# EAGLE design nametag (EAGLE 7.1.0)
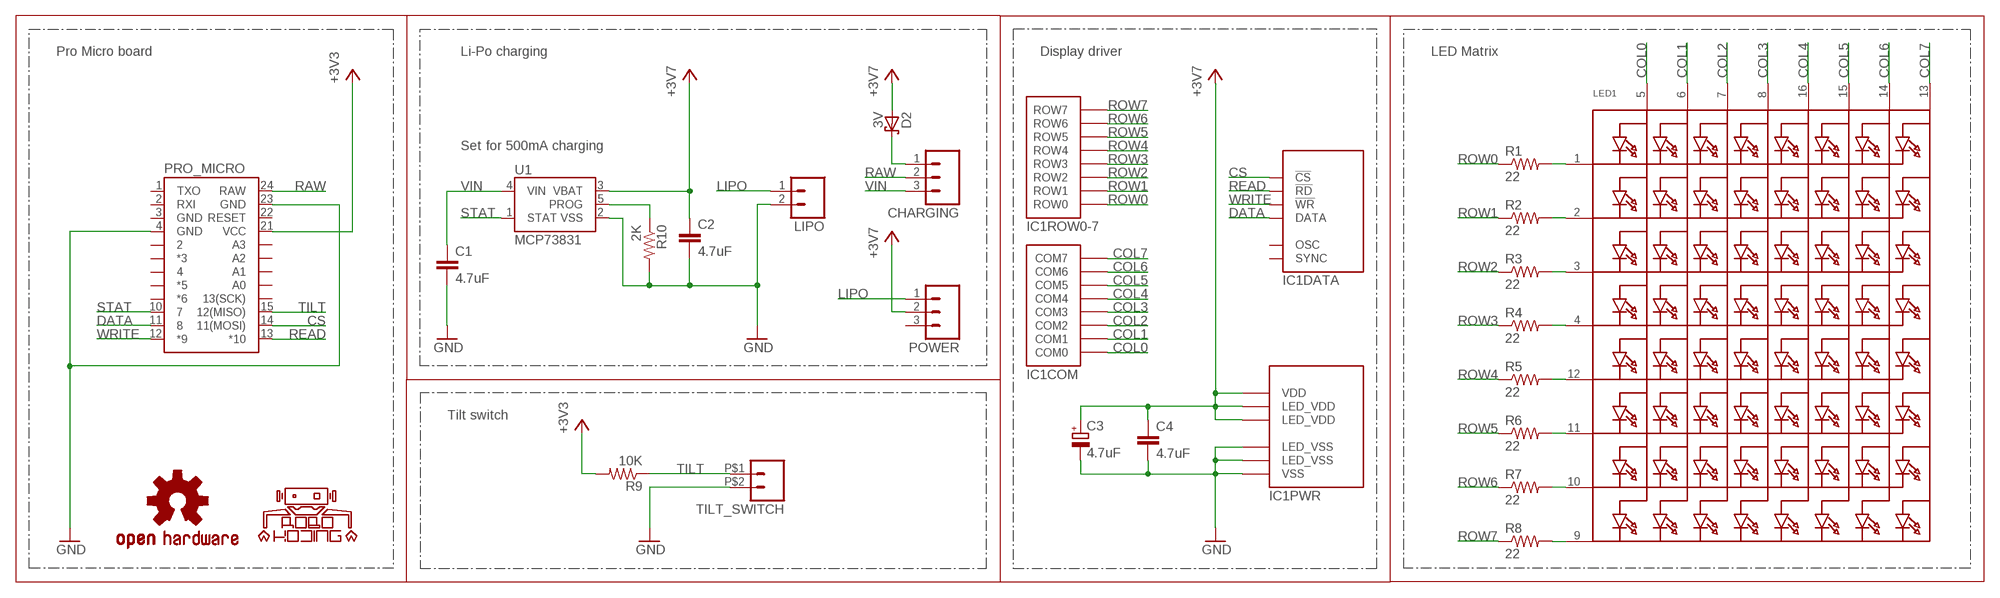
[diagram p0: schematic, sheet 1]

## Parts
C1  4.7uF  CAP0402-CAP  [0402-CAP]
C2  4.7uF  CAP0402-CAP  [0402-CAP]
C3  4.7uF  CPOL-EUB  [PANASONIC_B]
C4  4.7uF  CAP0402-CAP  [0402-CAP]
CHARGING  M03PTH  [1X03]
D2  3V  BAT60J  [SOD323_ST]
IC1  HT1632  [QFP52]
LED1  SEGMENT_8X8_ROWCATHODE  [SEGMENT_BL-M07C881UR]
LIPO  M02JST-PTH-VERT  [JST-2-PTH-VERT]
LOGO1  OSHW-LOGOS  [OSHW-LOGO-S]
LOGO2  ROBOKODING-LOGOS  [ROBOKODING-LOGO-S]
POWER  M03PTH  [1X03]
PRO_MICRO  ARDUINO_PRO_MICRO  [ARDUINO_PRO_MICRO]
R1  22  RESISTOR0402-RES  [0402-RES]
R2  22  RESISTOR0402-RES  [0402-RES]
R3  22  RESISTOR0402-RES  [0402-RES]
R4  22  RESISTOR0402-RES  [0402-RES]
R5  22  RESISTOR0402-RES  [0402-RES]
R6  22  RESISTOR0402-RES  [0402-RES]
R7  22  RESISTOR0402-RES  [0402-RES]
R8  22  RESISTOR0402-RES  [0402-RES]
R9  10K  RESISTOR0402-RES  [0402-RES]
R10  2K  RESISTOR0402-RES  [0402-RES]
TILT_SWITCH  M02PTH2  [1X02_BIG]
U1  MCP73831  [SOT23-5]

## Nets
+3V3: C2.1 C3.+ C4.1 D2.A IC1.P$7(PWR:LED_VDD) IC1.P$21(PWR:VDD) IC1.P$38(PWR:LED_VDD) POWER.2 U1.3(VBAT) ; supply symbol labelled +3V7
COL0: IC1.P$22(COM:COM0) LED1.5(A1)
COL1: IC1.P$23(COM:COM1) LED1.6(A2)
COL2: IC1.P$24(COM:COM2) LED1.7(A3)
COL3: IC1.P$26(COM:COM3) LED1.8(A4)
COL4: IC1.P$27(COM:COM4) LED1.16(A5)
COL5: IC1.P$28(COM:COM5) LED1.15(A6)
COL6: IC1.P$29(COM:COM6) LED1.14(A7)
COL7: IC1.P$30(COM:COM7) LED1.13(A8)
CS: IC1.P$19(DATA:!CS) PRO_MICRO.14(11(MOSI))
DATA: IC1.P$16(DATA:DATA) PRO_MICRO.11
GND: C1.2 C2.2 C3.- C4.2 IC1.P$14(PWR:VSS) IC1.P$25(PWR:LED_VSS) IC1.P$36(PWR:LED_VSS) LIPO.2 PRO_MICRO.4(GND) PRO_MICRO.23(GND) R10.2 TILT_SWITCH.P$2 U1.2(VSS)
LIPO: LIPO.1 POWER.1
N$1: LED1.1(K1) R1.2
N$2: LED1.2(K2) R2.2
N$3: CHARGING.1 D2.C
N$4: LED1.3(K3) R3.2
N$5: LED1.4(K4) R4.2
N$6: LED1.12(K5) R5.2
N$7: LED1.11(K6) R6.2
N$8: LED1.10(K7) R7.2
N$9: LED1.9(K8) R8.2
PROG: R10.1 U1.5(PROG)
RAW: CHARGING.2 PRO_MICRO.24(RAW)
READ: IC1.P$18(DATA:!RD) PRO_MICRO.13(*10)
ROW0: IC1.P$13(ROW0-7:ROW0) R1.1
ROW1: IC1.P$12(ROW0-7:ROW1) R2.1
ROW2: IC1.P$11(ROW0-7:ROW2) R3.1
ROW3: IC1.P$10(ROW0-7:ROW3) R4.1
ROW4: IC1.P$9(ROW0-7:ROW4) R5.1
ROW5: IC1.P$8(ROW0-7:ROW5) R6.1
ROW6: IC1.P$6(ROW0-7:ROW6) R7.1
ROW7: IC1.P$5(ROW0-7:ROW7) R8.1
STAT: PRO_MICRO.10 U1.1(STAT)
TILT: PRO_MICRO.15(12(MISO)) R9.1 TILT_SWITCH.P$1
VCC: PRO_MICRO.21(VCC) R9.2 ; supply symbol labelled +3V3
VIN: C1.1 CHARGING.3 U1.4(VIN)
WRITE: IC1.P$17(DATA:!WR) PRO_MICRO.12(*9)
Unconnected: IC1.P$1(ROW8-15:ROW11) IC1.P$2(ROW8-15:ROW10) IC1.P$3(ROW8-15:ROW9) IC1.P$4(ROW8-15:ROW8) IC1.P$15(DATA:OSC) IC1.P$20(DATA:SYNC) IC1.P$31(ROW24-31/COL8-15:ROW31) IC1.P$32(ROW24-31/COL8-15:ROW30) IC1.P$33(ROW24-31/COL8-15:ROW29) IC1.P$34(ROW24-31/COL8-15:ROW28) IC1.P$35(ROW24-31/COL8-15:ROW27) IC1.P$37(ROW24-31/COL8-15:ROW26) IC1.P$39(ROW24-31/COL8-15:ROW25) IC1.P$43(ROW16-23:ROW21) IC1.P$44(ROW16-23:ROW20) IC1.P$45(ROW16-23:ROW19) IC1.P$46(ROW16-23:ROW18) IC1.P$47(ROW16-23:ROW17) IC1.P$48(ROW16-23:ROW16) IC1.P$49(ROW8-15:ROW15) POWER.3 PRO_MICRO.1(TXO) PRO_MICRO.2(RXI) PRO_MICRO.3(GND) PRO_MICRO.22(RESET)

## Notes on the sheet
- Pro Micro board | Li-Po charging | Display driver | LED Matrix
- Set for 500mA charging
- Tilt switch

## Library data of the parts
C1 C2 C4 = SparkFun:CAP: Capacitor Standard 0603 ceramic capacitor, and 0.1" leaded capacitor.
C3 = rcl:CPOL-EU: POLARIZED CAPACITOR, European symbol
CHARGING POWER = SparkFun-Connectors:M03: Header 3 Standard 3-pin 0.1" header. Use with straight break away headers (SKU : PRT-00116), right angle break away headers (PRT-00553), swiss pins (PRT-00743), machine pins (PRT-00117), and female headers (PRT-00115). Molex polarized connector foot print use with SKU : PRT-08232 with associated crimp pins and housings.
D2 = diode:BAT60J: Schottky barrier diode Source: www.st.com, BAT60J.pdf
IC1 = ht1632:HT1632
LED1 = adafruit:SEGMENT_8X8_ROWCATHODE: 8x8 LED Segment Displays: Row = Cathode 0.7" Red 8X8 Matrix, 1.9mm Round LEDs - BL-M07C881UR 1.2" Red 8x8 Matrix, 3.0mm Round LEDs - BL-M12A881UR 1.2" Red 8x8 Matrix, 3.0mm Square LEDs - BL-M12A883
LIPO TILT_SWITCH = SparkFun-Connectors:M02: Standard 2-pin 0.1" header. Use with - straight break away headers ( PRT-00116) - right angle break away headers (PRT-00553) - swiss pins (PRT-00743) - machine pins (PRT-00117) - female headers (PRT-00115) Molex polarized connector foot print use with: PRT-08233 with associated crimp pins and housings. 2.54_SCREWTERM for use with PRT-10571. 3.5mm Screw Terminal footprints for PRT-08084 5mm Screw Terminal footprints for use with PRT-08432
LOGO1 = SparkFun-Aesthetics:OSHW-LOGO: Open Source Hardware Logo This logo indicates the piece of hardware it is found on incorporates a OSHW license and/or adheres to the definition of open source hardware found here: http://freedomdefined.org/OSHW
LOGO2 = Sumorobot:ROBOKODING-LOGO: Robokoding logo This logo indicates that the piece of hardware was developed by the RoboKoding community. RoboKoding is a organisation that focuses on teaching everyone building and programming robots: http://www.robokoding.com
PRO_MICRO = SparkFun-Boards:ARDUINO_PRO_MICRO
R1-R10 = SparkFun:RESISTOR: Resistor Basic schematic elements and footprints for 0603, 1206, and PTH resistors.
U1 = SparkFun:MCP73831: Microchip's MCP73831 Miniature single cell, fully integrated Li-Ion, Li-polymer charge management controller http://ww1.microchip.com/downloads/en/DeviceDoc/21984a.pdf

## Board
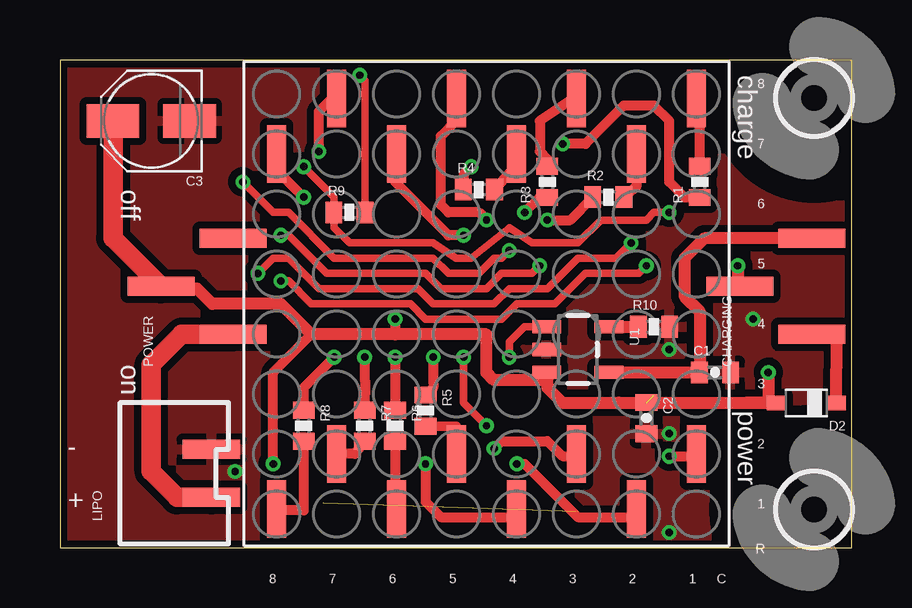
[diagram p1: board, top side]
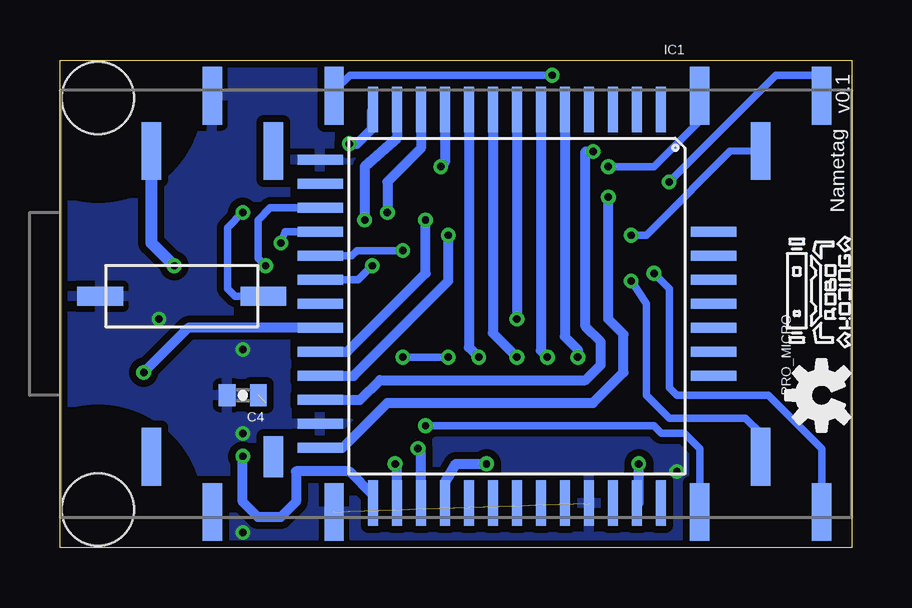
[diagram p2: board, bottom side, seen from below]

Size 33.02 x 20.32 mm. Coordinates in mm from the lower left corner, seen from the top.
Outline: 0,20.32 0,0 33.02,0 33.02,20.32 0,20.32
Copper layers (1*16): Top 0.035mm / dielectric 1.5mm / Bottom 0.035mm
Design rules "dirt_cheap_dirty_boards.v1": minimum track width 5mil, minimum drill 12mil, track to track 5mil, track to pad 5mil, pad to pad 5mil, via to via 5mil, smd to smd 0mil, copper to edge 10mil, drill to drill 10mil, minimum pad ring 10mil, minimum via ring 6mil, stop-mask expansion 2mil, vias tented up to drill 25mil, thermal gap 10mil

### Footprints (pad centres in the part's own frame; a part is rotated, then mirrored left to right if it is on the bottom)
0402-CAP = smd 0.7 x 0.9: 1 -0.65,0; 2 0.65,0
PANASONIC_B = smd 2.2 x 1.4: + 1.6,0; - -1.6,0
1X03 = smd 0.806 x 2.8: 1 0,-1.5; 2 2,1.5; 3 4,-1.5
SOD323_ST = smd 0.8 x 0.6: A 1.25,0; C -1.25,0
QFP52 = smd 0.406 x 1.9: P$1 -6,-8.1; P$2 -5,-8.1; P$3 -4,-8.1; P$4 -3,-8.1; P$5 -2,-8.1; P$6 -1,-8.1; P$7 0,-8.1; P$8 1,-8.1; P$9 2,-8.1; P$10 3,-8.1; P$11 4,-8.1; P$12 5,-8.1; P$13 6,-8.1; P$27 6,8.3; P$28 5,8.3; P$29 4,8.3; P$30 3,8.3; P$31 2,8.3; P$32 1,8.3; P$33 0,8.3; P$34 -1,8.3; P$35 -2,8.3; P$36 -3,8.3; P$37 -4,8.3; P$38 -5,8.3; P$39 -6,8.3 | smd 1.9 x 0.406: P$14 8.2,-6; P$15 8.2,-5; P$16 8.2,-4; P$17 8.2,-3; P$18 8.2,-2; P$19 8.2,-1; P$20 8.2,0; P$21 8.2,1; P$22 8.2,2; P$23 8.2,3; P$24 8.2,4; P$25 8.2,5; P$26 8.2,6; P$43 -8.2,3; P$44 -8.2,2; P$45 -8.2,1; P$46 -8.2,0; P$47 -8.2,-1; P$48 -8.2,-2; P$49 -8.2,-3
SEGMENT_BL-M07C881UR = smd 0.806 x 2.4: 1 -8.75,-8.55; 2 -6.25,-6.25; 3 -3.75,-8.55; 4 -1.25,-6.25; 5 1.25,-8.55; 6 3.75,-6.25; 7 6.25,-8.55; 8 8.75,-6.25; 9 8.75,8.55; 10 6.25,6.25; 11 3.75,8.55; 12 1.25,6.25; 13 -1.25,8.55; 14 -3.75,6.25; 15 -6.25,8.55; 16 -8.75,6.25
JST-2-PTH-VERT = smd 0.806 x 2.4: 1 -1,-1.55; 2 1,-1.55
ARDUINO_PRO_MICRO = smd 2.4 x 0.806: 1 -6.37,12.7; 2 -8.67,10.16; 4 -8.67,5.08; 10 -8.67,-10.16; 11 -6.37,-12.7; 12 -8.67,-15.24; 13 8.67,-15.24; 14 6.37,-12.7; 15 8.67,-10.16; 21 8.67,5.08; 22 6.37,7.62; 23 8.67,10.16; 24 6.37,12.7 | smd 1.7 x 0.806: 3 -6.37,7.62
0402-RES = smd 0.7 x 0.9: 1 -0.65,0; 2 0.65,0
1X02_BIG = smd 1.9 x 0.806: P$1 -1.5,0; P$2 5.31,0
SOT23-5 = smd 0.55 x 1.2: 1 -0.95,-1.3; 2 0,-1.3; 3 0.95,-1.3; 4 0.95,1.3; 5 -0.95,1.3
3,0 = hole 3: 0,0

### Placement (x,y rotation side)
C1  27.3,7.3 0 top
C2  24.45,5.4 270 top
C3  3.81,17.78 180 top
C4  25.4,6.35 180 bottom
CHARGING  29.84,8.89 90 top
D2  31.11,6.03 180 top
IC1  13.97,10.16 180 bottom
LED1  17.78,10.16 180 top
LIPO  4.76,3.1 90 top
LOGO1  1.27,6.35 90 bottom
LOGO2  0,8.26 90 bottom
POWER  5.71,8.89 90 top
PRO_MICRO  16.51,10.16 90 bottom
R1  26.67,15.24 90 top
R2  22.86,14.61 0 top
R3  20.32,15.24 90 top
R4  17.46,14.92 0 top
R5  15.24,5.71 270 top
R6  13.97,5.08 270 top
R7  12.7,5.08 270 top
R8  10.16,5.08 270 top
R9  12.06,13.97 0 top
R10  24.77,9.21 0 top
TILT_SWITCH  26.04,10.48 180 bottom
U1  21.59,8.26 270 top
U$1  [3,0]  31.43,18.73 0 top
U$2  [3,0]  31.43,1.59 0 top

### Tracks (layer width: path | path; a pad name or v marks a point on that pad's centre or on a via)
+3V3  (via drill 0.31)  (1 unrouted)
  Top 0.406: v13.97,9.53 13.97,8.89 | v8.89,3.49 8.89,7.3 10.48,8.89
  Top 0.508: POWER.2 4.31,10.79 5.71,10.79 6.35,10.16 9.21,10.16 10.48,8.89 13.97,8.89 17.78,8.89 17.78,7.3 18.1,6.99 20.32,6.99 U1.3 20.32,6.67 20.95,6.03 arc0 C2.1 29.53,6.03 | v29.53,7.3 29.53,6.03 | 29.53,6.03 28.57,6.03 | 29.53,6.03 D2.A
  Top 0.813: C3.+ 2.21,12.89 POWER.2
  Bottom 0.406: IC1.P$7 v13.97,9.53 | IC1.P$21 27.67,9.16 v29.53,7.3 | IC1.P$38 8.89,1.86 v8.89,3.49
COL0  (via drill 0.31)
  Top 0.406: v17.78,13.65 17.46,13.97 16.19,13.97 15.88,14.29 15.88,17.14 16.51,17.78 16.51,18.71 | 16.53,18.91 16.51,18.89 16.51,18.73 16.51,18.71 | LED1.5 16.51,18.71
  Bottom 0.406: IC1.P$22 21.05,8.16 17.78,11.43 v17.78,13.65
COL1  (via drill 0.31)
  Top 0.406: v16.83,13.02 16.19,13.02 13.97,15.24 13.97,16.35 LED1.6
  Bottom 0.406: IC1.P$23 20.78,7.16 16.83,11.11 v16.83,13.02
COL2  (via drill 0.31)
  Top 0.406: v10.79,16.51 10.79,18.18 11.39,18.77 | 11.39,18.77 11.53,18.91 | LED1.7 11.39,18.71 11.39,18.77
  Bottom 0.406: IC1.P$24 20.51,6.16 19.68,6.99 11.11,6.99 10.48,7.62 10.48,8.57 11.11,9.21 11.11,16.51 v10.79,16.51
COL3  (via drill 0.31)
  Top 0.406: v10.16,14.61 9.03,15.73 LED1.8
  Bottom 0.406: IC1.P$26 21.24,4.16 19.37,6.03 10.79,6.03 9.53,7.3 9.53,8.89 10.16,9.53 v10.16,14.61
COL4  (via drill 0.31)
  Top 0.406: v25.4,3.81 26.43,3.81 LED1.16
  Bottom 0.406: IC1.P$27 19.97,2.19 20.95,3.17 23.18,3.17 23.18,1.91 23.81,1.27 24.77,1.27 25.4,1.91 v25.4,3.81
COL5  (via drill 0.31)
  Top 0.406: v19.05,3.49 19.37,3.49 21.59,1.27 23.89,1.27 24.03,1.41 LED1.15
  Bottom 0.406: IC1.P$28 18.97,3.25 v19.05,3.49
COL6  (via drill 0.31)
  Top 0.406: v18.1,4.13 18.41,4.45 20.32,4.45 20.95,3.81 21.43,3.81 LED1.14
  Bottom 0.406: IC1.P$29 17.97,3.94 v18.1,4.13
COL7  (via drill 0.31)
  Top 0.406: v15.24,3.49 15.24,1.91 15.88,1.27 18.89,1.27 19.03,1.41 LED1.13
  Bottom 0.406: IC1.P$30 16.97,2.71 16.51,3.49 v15.24,3.49
CS  (via drill 0.31)
  Top 0.305: v20,11.75 19.68,11.43 18.41,11.43 17.78,10.79 15.88,10.79 15.24,11.43 11.11,11.43 9.53,13.02 v9.21,13.02
  Bottom 0.305: IC1.P$19 20.59,11.16 v20,11.75 | v9.21,13.02 8.57,13.02 8.26,13.34 5.1,16.51 PRO_MICRO.14
DATA  (via drill 0.31)
  Top 0.305: v24.45,11.75 24.13,11.43 21.91,11.43 20.64,10.16 19.05,10.16 18.41,9.53 15.24,9.53 14.61,10.16 10.48,10.16 9.53,11.11 v9.21,11.11
  Bottom 0.305: IC1.P$16 24.26,14.16 24.77,13.65 24.77,12.06 v24.45,11.75 | v9.21,11.11 8.57,10.16 8.57,6.35 7.62,5.4 4.45,5.4 3.81,4.76 PRO_MICRO.11
GND  (via drill 0.31)  (1 unrouted)
  other vias: 25.4,0.64 25.4,8.26 7.3,3.17 25.4,4.76 28.89,9.53
  pour Bottom (isolate 0.3): -0.64,20.95 33.66,20.95 33.66,-0.64 -0.64,-0.64
  pour Top (isolate 0.3): -0.32,20.64 33.34,20.64 33.34,-0.32 -0.32,-0.32
LIPO
  Top 0.813: LIPO.1 4.88,2.1 3.81,3.17 3.81,7.62 5.08,8.89 POWER.1
N$1
  Top 0.406: R1.2 26.67,18.77 | 26.67,18.77 26.53,18.91 | 26.67,18.77 26.53,18.77 LED1.1
N$2
  Top 0.406: LED1.2 24.03,15.04 R2.2
N$3
  Top 0.508: D2.C 32.38,8.89 31.43,8.89 31.41,8.96 CHARGING.1
N$4
  Top 0.406: 21.53,18.91 21.53,18.81 | LED1.3 21.53,18.81 | 21.53,18.81 20,17.78 20,16.51 20.32,16.19 R3.2
N$5
  Top 0.406: LED1.4 19.03,15.91 R4.2
N$6
  Top 0.406: LED1.12 16.53,5.04 R5.2
N$7
  Top 0.406: R6.2 13.97,1.47 14.03,1.41 LED1.11
N$8
  Top 0.406: R7.2 12.7,4.45 12.28,3.91 LED1.10
N$9
  Top 0.406: R8.2 10.16,1.55 9.03,1.55 | 9.03,1.41 8.89,1.55 9.03,1.55 | 9.03,1.55 LED1.9
PROG
  Top 0.508: U1.5 22.86,9.21 R10.1
RAW  (via drill 0.31)
  Top 0.508: v28.26,11.75 28.26,10.98 CHARGING.2
  Bottom 0.508: PRO_MICRO.24 29.21,12.7 v28.26,11.75
READ  (via drill 0.31)
  Top 0.305: v18.73,12.38 18.41,12.06 18.1,12.06 17.46,11.43 16.19,11.43 15.56,12.06 11.43,12.06 9.53,13.97 8.89,13.97 v7.62,15.24
  Bottom 0.305: IC1.P$18 20.86,12.16 20.64,12.38 v18.73,12.38 | 1.27,19.03 1.29,19.68 3.17,19.68 v7.62,15.24
  Bottom 0.406: 1.27,19.03 PRO_MICRO.13
ROW0  (via drill 0.31)
  Top 0.406: R1.1 26.05,14.59 25.4,15.24 25.4,17.78 24.77,18.41 23.5,18.41 21.91,16.83 v20.95,16.83
  Bottom 0.406: v20.95,16.83 20.64,16.83 20,17.46 20,18.23 IC1.P$13
ROW1  (via drill 0.31)
  Top 0.406: v20.32,13.65 21.27,13.65 R2.1
  Bottom 0.406: IC1.P$12 18.97,17.07 20.32,15.88 v20.32,13.65
ROW2  (via drill 0.31)
  Top 0.406: v19.37,13.97 20,14.61 R3.1
  Bottom 0.406: IC1.P$11 17.97,16.64 19.37,15.24 v19.37,13.97
ROW3  (via drill 0.31)
  Top 0.406: v17.14,15.88 16.83,15.57 R4.1
  Bottom 0.406: IC1.P$10 16.97,16.05 v17.14,15.88
ROW4  (via drill 0.31)
  Top 0.406: v15.56,7.94 15.56,6.99 15.57,6.68 R5.1
  Bottom 0.406: IC1.P$9 15.97,8.35 v15.56,7.94
ROW5  (via drill 0.31)
  Top 0.406: v13.97,7.94 R6.1
  Bottom 0.406: IC1.P$8 14.97,8.94 v13.97,7.94
ROW6  (via drill 0.31)
  Top 0.406: v12.7,7.94 12.7,6.99 12.71,6.99 R7.1
  Bottom 0.406: IC1.P$6 12.97,8.21 v12.7,7.94
ROW7  (via drill 0.31)
  Top 0.406: v11.43,7.94 10.16,6.67 R8.1
  Bottom 0.406: IC1.P$5 11.97,8.79 11.43,8.26 v11.43,7.94
STAT  (via drill 0.31)
  Top 0.305: v17.78,5.08 16.83,6.03 v16.83,7.94 | v18.73,7.94 18.73,8.57 19.37,9.21 U1.1
  Bottom 0.305: PRO_MICRO.10 6.35,4.13 6.99,4.76 7.94,4.76 8.26,5.08 v17.78,5.08 | v16.83,7.94 v18.73,7.94
  Bottom 0.406: 6.35,1.29 PRO_MICRO.10
TILT  (via drill 0.31)
  Top 0.305: v25.4,13.97 24.77,13.97 24.45,13.65 22.54,13.65 21.59,12.7 19.68,12.7 18.73,13.34 17.14,12.06 16.51,12.06 15.56,12.7 12.06,12.7 11.43,13.34 11.43,14.27 | 11.43,14.61 11.43,14.27 | 11.43,14.27 R9.1 11.43,14.61 | 11.43,14.61 v10.16,15.88
  Bottom 0.305: TILT_SWITCH.P$1 25.72,10.48 26.04,10.79 26.04,13.34 v25.4,13.97 | v10.16,15.88 8.26,15.88 6.35,17.78 PRO_MICRO.15
  Bottom 0.406: 6.35,19.03 PRO_MICRO.15
VCC  (via drill 0.31)
  Top 0.305: R9.2 12.71,19.45 v12.5,19.68
  Bottom 0.305: v12.5,19.68 20.93,19.68 21.59,19.03
  Bottom 0.406: PRO_MICRO.21 21.59,19.03
VIN
  Top 0.508: U1.4 22.86,7.3 C1.1 26.67,7.95 26.67,9.84 26.04,10.48 26.04,12.06 26.86,12.89 CHARGING.3
WRITE  (via drill 0.31)
  Top 0.305: v23.81,12.7 23.18,12.06 21.59,12.06 20.32,10.79 18.73,10.79 18.1,10.16 15.56,10.16 14.92,10.79 10.79,10.79 9.53,12.06 8.89,12.06 v8.26,11.43
  Bottom 0.305: IC1.P$17 23.64,13.16 v23.81,12.7 | v8.26,11.43 7.62,10.79 7.62,6.67 7.3,6.35 3.49,6.35 1.27,4.13 1.27,1.59 | PRO_MICRO.12 1.27,1.29
  Bottom 0.406: PRO_MICRO.12 1.27,1.59

### Text on the board
_tsilk: charge | off | on | power | - | +
_bsilk: v0.1 | Nametag